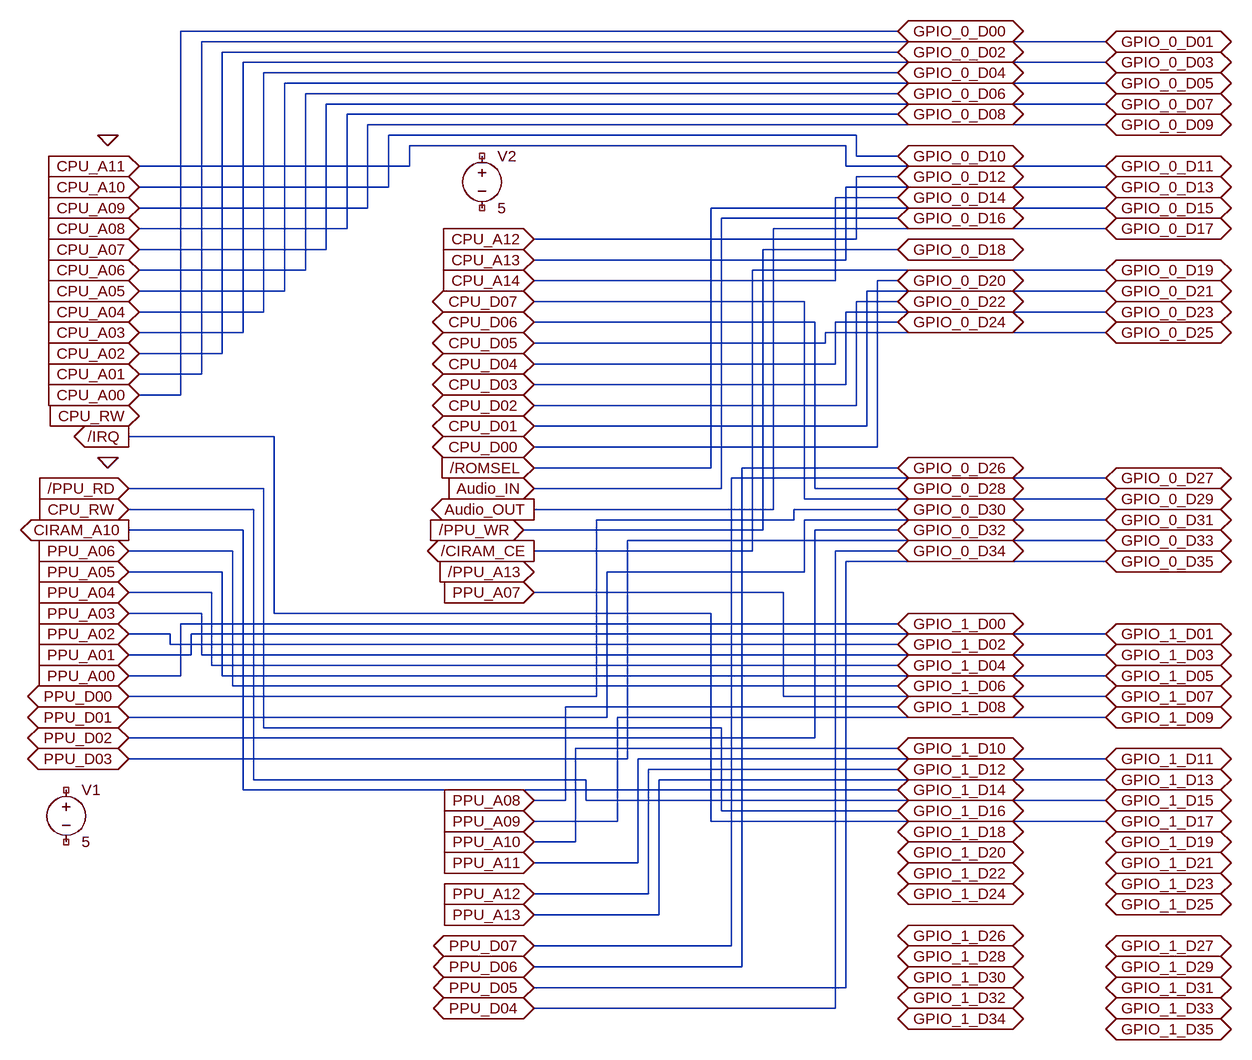
[diagram p0: schematic nes-io.asc]
nes-io.asc, the LTspice schematic file:
Version 4
SHEET 1 880 716
WIRE -1264 -1264 -2368 -1264
WIRE -944 -1248 -2336 -1248
WIRE -1264 -1232 -2304 -1232
WIRE -944 -1216 -2272 -1216
WIRE -1264 -1200 -2240 -1200
WIRE -944 -1184 -2208 -1184
WIRE -1264 -1168 -2176 -1168
WIRE -944 -1152 -2144 -1152
WIRE -1264 -1136 -2112 -1136
WIRE -944 -1120 -2080 -1120
WIRE -1328 -1104 -2048 -1104
WIRE -1344 -1088 -2016 -1088
WIRE -1328 -1072 -1328 -1104
WIRE -1264 -1072 -1328 -1072
WIRE -2016 -1056 -2016 -1088
WIRE -2016 -1056 -2432 -1056
WIRE -1344 -1056 -1344 -1088
WIRE -944 -1056 -1344 -1056
WIRE -1264 -1040 -1328 -1040
WIRE -2048 -1024 -2048 -1104
WIRE -2048 -1024 -2432 -1024
WIRE -944 -1024 -1344 -1024
WIRE -1264 -1008 -1360 -1008
WIRE -2080 -992 -2080 -1120
WIRE -2080 -992 -2432 -992
WIRE -944 -992 -1552 -992
WIRE -1264 -976 -1536 -976
WIRE -2112 -960 -2112 -1136
WIRE -2112 -960 -2432 -960
WIRE -944 -960 -1456 -960
WIRE -1328 -944 -1328 -1040
WIRE -1328 -944 -1824 -944
WIRE -2144 -928 -2144 -1152
WIRE -2144 -928 -2432 -928
WIRE -1264 -928 -1472 -928
WIRE -1344 -912 -1344 -1024
WIRE -1344 -912 -1824 -912
WIRE -2176 -896 -2176 -1168
WIRE -2176 -896 -2432 -896
WIRE -944 -896 -1488 -896
WIRE -1360 -880 -1360 -1008
WIRE -1360 -880 -1824 -880
WIRE -1264 -880 -1296 -880
WIRE -2208 -864 -2208 -1184
WIRE -2208 -864 -2432 -864
WIRE -944 -864 -1312 -864
WIRE -1408 -848 -1824 -848
WIRE -1264 -848 -1328 -848
WIRE -2240 -832 -2240 -1200
WIRE -2240 -832 -2432 -832
WIRE -944 -832 -1344 -832
WIRE -1392 -816 -1824 -816
WIRE -1264 -816 -1360 -816
WIRE -2272 -800 -2272 -1216
WIRE -2272 -800 -2432 -800
WIRE -944 -800 -1376 -800
WIRE -1376 -784 -1376 -800
WIRE -1376 -784 -1824 -784
WIRE -2304 -768 -2304 -1232
WIRE -2304 -768 -2432 -768
WIRE -1360 -752 -1360 -816
WIRE -1360 -752 -1824 -752
WIRE -2336 -736 -2336 -1248
WIRE -2336 -736 -2432 -736
WIRE -1344 -720 -1344 -832
WIRE -1344 -720 -1824 -720
WIRE -2368 -704 -2368 -1264
WIRE -2368 -704 -2432 -704
WIRE -1328 -688 -1328 -848
WIRE -1328 -688 -1824 -688
WIRE -1312 -656 -1312 -864
WIRE -1312 -656 -1824 -656
WIRE -2224 -640 -2448 -640
WIRE -1296 -624 -1296 -880
WIRE -1296 -624 -1824 -624
WIRE -1552 -592 -1552 -992
WIRE -1552 -592 -1824 -592
WIRE -1264 -592 -1504 -592
WIRE -944 -576 -1520 -576
WIRE -2240 -560 -2448 -560
WIRE -1536 -560 -1536 -976
WIRE -1536 -560 -1824 -560
WIRE -1392 -560 -1392 -816
WIRE -1264 -560 -1392 -560
WIRE -1408 -544 -1408 -848
WIRE -944 -544 -1408 -544
WIRE -2256 -528 -2448 -528
WIRE -1456 -528 -1456 -960
WIRE -1456 -528 -1824 -528
WIRE -1264 -528 -1424 -528
WIRE -1424 -512 -1424 -528
WIRE -1424 -512 -1728 -512
WIRE -944 -512 -1408 -512
WIRE -2272 -496 -2448 -496
WIRE -1472 -496 -1472 -928
WIRE -1472 -496 -1840 -496
WIRE -1264 -496 -1392 -496
WIRE -944 -480 -1680 -480
WIRE -2288 -464 -2448 -464
WIRE -1488 -464 -1488 -896
WIRE -1488 -464 -1824 -464
WIRE -1264 -464 -1360 -464
WIRE -944 -448 -1344 -448
WIRE -2304 -432 -2448 -432
WIRE -1408 -432 -1408 -512
WIRE -1408 -432 -1712 -432
WIRE -2320 -400 -2448 -400
WIRE -1440 -400 -1824 -400
WIRE -2336 -368 -2448 -368
WIRE -2224 -368 -2224 -640
WIRE -1552 -368 -2224 -368
WIRE -1264 -352 -2368 -352
WIRE -2384 -336 -2448 -336
WIRE -944 -336 -2352 -336
WIRE -2384 -320 -2384 -336
WIRE -1264 -320 -2384 -320
WIRE -2352 -304 -2352 -336
WIRE -2352 -304 -2448 -304
WIRE -2336 -304 -2336 -368
WIRE -944 -304 -2336 -304
WIRE -2320 -288 -2320 -400
WIRE -1264 -288 -2320 -288
WIRE -2368 -272 -2368 -352
WIRE -2368 -272 -2448 -272
WIRE -2304 -272 -2304 -432
WIRE -944 -272 -2304 -272
WIRE -2288 -256 -2288 -464
WIRE -1264 -256 -2288 -256
WIRE -1728 -240 -1728 -512
WIRE -1728 -240 -2448 -240
WIRE -1440 -240 -1440 -400
WIRE -944 -240 -1440 -240
WIRE -1264 -224 -1776 -224
WIRE -1712 -208 -1712 -432
WIRE -1712 -208 -2448 -208
WIRE -944 -208 -1696 -208
WIRE -2240 -192 -2240 -560
WIRE -1536 -192 -2240 -192
WIRE -1392 -176 -1392 -496
WIRE -1392 -176 -2448 -176
WIRE -1264 -160 -1760 -160
WIRE -1680 -144 -1680 -480
WIRE -1680 -144 -2448 -144
WIRE -944 -144 -1664 -144
WIRE -1264 -128 -1648 -128
WIRE -2256 -112 -2256 -528
WIRE -1744 -112 -2256 -112
WIRE -944 -112 -1632 -112
WIRE -2272 -96 -2272 -496
WIRE -1264 -96 -2272 -96
WIRE -1776 -80 -1776 -224
WIRE -1776 -80 -1824 -80
WIRE -1744 -80 -1744 -112
WIRE -944 -80 -1744 -80
WIRE -1536 -64 -1536 -192
WIRE -1264 -64 -1536 -64
WIRE -1696 -48 -1696 -208
WIRE -1696 -48 -1824 -48
WIRE -1552 -48 -1552 -368
WIRE -944 -48 -1552 -48
WIRE -1760 -16 -1760 -160
WIRE -1760 -16 -1824 -16
WIRE -1664 16 -1664 -144
WIRE -1664 16 -1824 16
WIRE -1648 64 -1648 -128
WIRE -1648 64 -1824 64
WIRE -1632 96 -1632 -112
WIRE -1632 96 -1824 96
WIRE -1520 144 -1520 -576
WIRE -1520 144 -1824 144
WIRE -1504 176 -1504 -592
WIRE -1504 176 -1824 176
WIRE -1344 208 -1344 -448
WIRE -1344 208 -1824 208
WIRE -1360 240 -1360 -464
WIRE -1360 240 -1824 240
FLAG -2480 -1104 0
FLAG -2432 -1056 CPU_A11
IOPIN -2432 -1056 In
FLAG -2432 -1024 CPU_A10
IOPIN -2432 -1024 In
FLAG -2432 -992 CPU_A09
IOPIN -2432 -992 In
FLAG -2432 -960 CPU_A08
IOPIN -2432 -960 In
FLAG -2432 -928 CPU_A07
IOPIN -2432 -928 In
FLAG -2432 -896 CPU_A06
IOPIN -2432 -896 In
FLAG -2432 -864 CPU_A05
IOPIN -2432 -864 In
FLAG -2432 -832 CPU_A04
IOPIN -2432 -832 In
FLAG -2432 -800 CPU_A03
IOPIN -2432 -800 In
FLAG -2432 -768 CPU_A02
IOPIN -2432 -768 In
FLAG -2432 -736 CPU_A01
IOPIN -2432 -736 In
FLAG -2432 -704 CPU_A00
IOPIN -2432 -704 In
FLAG -2432 -672 CPU_RW
IOPIN -2432 -672 In
FLAG -2448 -640 /IRQ
IOPIN -2448 -640 Out
FLAG -2480 -608 0
FLAG -2448 -496 CIRAM_A10
IOPIN -2448 -496 Out
FLAG -2448 -560 /PPU_RD
IOPIN -2448 -560 In
FLAG -2448 -528 CPU_RW
IOPIN -2448 -528 In
FLAG -2448 -464 PPU_A06
IOPIN -2448 -464 In
FLAG -2448 -432 PPU_A05
IOPIN -2448 -432 In
FLAG -2448 -400 PPU_A04
IOPIN -2448 -400 In
FLAG -2448 -368 PPU_A03
IOPIN -2448 -368 In
FLAG -2448 -336 PPU_A02
IOPIN -2448 -336 In
FLAG -2448 -304 PPU_A01
IOPIN -2448 -304 In
FLAG -2448 -272 PPU_A00
IOPIN -2448 -272 In
FLAG -2448 -240 PPU_D00
IOPIN -2448 -240 BiDir
FLAG -2448 -208 PPU_D01
IOPIN -2448 -208 BiDir
FLAG -2448 -176 PPU_D02
IOPIN -2448 -176 BiDir
FLAG -2448 -144 PPU_D03
IOPIN -2448 -144 BiDir
FLAG -1824 -848 CPU_D07
IOPIN -1824 -848 BiDir
FLAG -1824 -944 CPU_A12
IOPIN -1824 -944 In
FLAG -1824 -912 CPU_A13
IOPIN -1824 -912 In
FLAG -1824 -880 CPU_A14
IOPIN -1824 -880 In
FLAG -1824 -816 CPU_D06
IOPIN -1824 -816 BiDir
FLAG -1824 -784 CPU_D05
IOPIN -1824 -784 BiDir
FLAG -1824 -752 CPU_D04
IOPIN -1824 -752 BiDir
FLAG -1824 -720 CPU_D03
IOPIN -1824 -720 BiDir
FLAG -1824 -688 CPU_D02
IOPIN -1824 -688 BiDir
FLAG -1824 -656 CPU_D01
IOPIN -1824 -656 BiDir
FLAG -1824 -624 CPU_D00
IOPIN -1824 -624 BiDir
FLAG -1824 -592 /ROMSEL
IOPIN -1824 -592 In
FLAG -1824 -560 Audio_IN
IOPIN -1824 -560 In
FLAG -1824 -528 Audio_OUT
IOPIN -1824 -528 Out
FLAG -1840 -496 /PPU_WR
IOPIN -1840 -496 In
FLAG -1824 -464 /CIRAM_CE
IOPIN -1824 -464 Out
FLAG -1824 -432 /PPU_A13
IOPIN -1824 -432 In
FLAG -1824 -400 PPU_A07
IOPIN -1824 -400 In
FLAG -1824 -80 PPU_A08
IOPIN -1824 -80 In
FLAG -1824 -48 PPU_A09
IOPIN -1824 -48 In
FLAG -1824 -16 PPU_A10
IOPIN -1824 -16 In
FLAG -1824 16 PPU_A11
IOPIN -1824 16 In
FLAG -1824 64 PPU_A12
IOPIN -1824 64 In
FLAG -1824 96 PPU_A13
IOPIN -1824 96 In
FLAG -1824 144 PPU_D07
IOPIN -1824 144 BiDir
FLAG -1824 176 PPU_D06
IOPIN -1824 176 BiDir
FLAG -1824 208 PPU_D05
IOPIN -1824 208 BiDir
FLAG -1824 240 PPU_D04
IOPIN -1824 240 BiDir
FLAG -1264 -1264 GPIO_0_D00
IOPIN -1264 -1264 BiDir
FLAG -1264 -1232 GPIO_0_D02
IOPIN -1264 -1232 BiDir
FLAG -1264 -1200 GPIO_0_D04
IOPIN -1264 -1200 BiDir
FLAG -1264 -1168 GPIO_0_D06
IOPIN -1264 -1168 BiDir
FLAG -1264 -1136 GPIO_0_D08
IOPIN -1264 -1136 BiDir
FLAG -1264 -1072 GPIO_0_D10
IOPIN -1264 -1072 BiDir
FLAG -1264 -1040 GPIO_0_D12
IOPIN -1264 -1040 BiDir
FLAG -1264 -1008 GPIO_0_D14
IOPIN -1264 -1008 BiDir
FLAG -1264 -976 GPIO_0_D16
IOPIN -1264 -976 BiDir
FLAG -1264 -928 GPIO_0_D18
IOPIN -1264 -928 BiDir
FLAG -1264 -880 GPIO_0_D20
IOPIN -1264 -880 BiDir
FLAG -1264 -848 GPIO_0_D22
IOPIN -1264 -848 BiDir
FLAG -1264 -816 GPIO_0_D24
IOPIN -1264 -816 BiDir
FLAG -1264 -592 GPIO_0_D26
IOPIN -1264 -592 BiDir
FLAG -1264 -560 GPIO_0_D28
IOPIN -1264 -560 BiDir
FLAG -1264 -528 GPIO_0_D30
IOPIN -1264 -528 BiDir
FLAG -1264 -496 GPIO_0_D32
IOPIN -1264 -496 BiDir
FLAG -1264 -464 GPIO_0_D34
IOPIN -1264 -464 BiDir
FLAG -944 -1248 GPIO_0_D01
IOPIN -944 -1248 BiDir
FLAG -944 -1216 GPIO_0_D03
IOPIN -944 -1216 BiDir
FLAG -944 -1184 GPIO_0_D05
IOPIN -944 -1184 BiDir
FLAG -944 -1152 GPIO_0_D07
IOPIN -944 -1152 BiDir
FLAG -944 -1120 GPIO_0_D09
IOPIN -944 -1120 BiDir
FLAG -944 -1056 GPIO_0_D11
IOPIN -944 -1056 BiDir
FLAG -944 -1024 GPIO_0_D13
IOPIN -944 -1024 BiDir
FLAG -944 -992 GPIO_0_D15
IOPIN -944 -992 BiDir
FLAG -944 -960 GPIO_0_D17
IOPIN -944 -960 BiDir
FLAG -944 -896 GPIO_0_D19
IOPIN -944 -896 BiDir
FLAG -944 -864 GPIO_0_D21
IOPIN -944 -864 BiDir
FLAG -944 -832 GPIO_0_D23
IOPIN -944 -832 BiDir
FLAG -944 -800 GPIO_0_D25
IOPIN -944 -800 BiDir
FLAG -944 -576 GPIO_0_D27
IOPIN -944 -576 BiDir
FLAG -944 -544 GPIO_0_D29
IOPIN -944 -544 BiDir
FLAG -944 -512 GPIO_0_D31
IOPIN -944 -512 BiDir
FLAG -944 -480 GPIO_0_D33
IOPIN -944 -480 BiDir
FLAG -944 -448 GPIO_0_D35
IOPIN -944 -448 BiDir
FLAG -1264 -352 GPIO_1_D00
IOPIN -1264 -352 BiDir
FLAG -1264 -320 GPIO_1_D02
IOPIN -1264 -320 BiDir
FLAG -1264 -288 GPIO_1_D04
IOPIN -1264 -288 BiDir
FLAG -1264 -256 GPIO_1_D06
IOPIN -1264 -256 BiDir
FLAG -1264 -224 GPIO_1_D08
IOPIN -1264 -224 BiDir
FLAG -1264 -160 GPIO_1_D10
IOPIN -1264 -160 BiDir
FLAG -1264 -128 GPIO_1_D12
IOPIN -1264 -128 BiDir
FLAG -1264 -96 GPIO_1_D14
IOPIN -1264 -96 BiDir
FLAG -1264 -64 GPIO_1_D16
IOPIN -1264 -64 BiDir
FLAG -1264 -32 GPIO_1_D18
IOPIN -1264 -32 BiDir
FLAG -1264 0 GPIO_1_D20
IOPIN -1264 0 BiDir
FLAG -1264 32 GPIO_1_D22
IOPIN -1264 32 BiDir
FLAG -1264 64 GPIO_1_D24
IOPIN -1264 64 BiDir
FLAG -1264 128 GPIO_1_D26
IOPIN -1264 128 BiDir
FLAG -1264 160 GPIO_1_D28
IOPIN -1264 160 BiDir
FLAG -1264 192 GPIO_1_D30
IOPIN -1264 192 BiDir
FLAG -1264 224 GPIO_1_D32
IOPIN -1264 224 BiDir
FLAG -1264 256 GPIO_1_D34
IOPIN -1264 256 BiDir
FLAG -944 -336 GPIO_1_D01
IOPIN -944 -336 BiDir
FLAG -944 -304 GPIO_1_D03
IOPIN -944 -304 BiDir
FLAG -944 -272 GPIO_1_D05
IOPIN -944 -272 BiDir
FLAG -944 -240 GPIO_1_D07
IOPIN -944 -240 BiDir
FLAG -944 -208 GPIO_1_D09
IOPIN -944 -208 BiDir
FLAG -944 -144 GPIO_1_D11
IOPIN -944 -144 BiDir
FLAG -944 -112 GPIO_1_D13
IOPIN -944 -112 BiDir
FLAG -944 -80 GPIO_1_D15
IOPIN -944 -80 BiDir
FLAG -944 -48 GPIO_1_D17
IOPIN -944 -48 BiDir
FLAG -944 -16 GPIO_1_D19
IOPIN -944 -16 BiDir
FLAG -944 16 GPIO_1_D21
IOPIN -944 16 BiDir
FLAG -944 48 GPIO_1_D23
IOPIN -944 48 BiDir
FLAG -944 80 GPIO_1_D25
IOPIN -944 80 BiDir
FLAG -944 144 GPIO_1_D27
IOPIN -944 144 BiDir
FLAG -944 176 GPIO_1_D29
IOPIN -944 176 BiDir
FLAG -944 208 GPIO_1_D31
IOPIN -944 208 BiDir
FLAG -944 240 GPIO_1_D33
IOPIN -944 240 BiDir
FLAG -944 272 GPIO_1_D35
IOPIN -944 272 BiDir
SYMBOL voltage -2544 -112 R0
WINDOW 123 0 0 Left 2
WINDOW 39 0 0 Left 2
SYMATTR InstName V1
SYMATTR Value 5
SYMBOL voltage -1904 -1088 R0
WINDOW 123 0 0 Left 2
WINDOW 39 0 0 Left 2
SYMATTR InstName V2
SYMATTR Value 5

The netlist it stands for:
* nes-io.asc
V1 NC_01 NC_02 5
V2 NC_03 NC_04 5
.backanno
.end